# EAGLE design RallyESP_Shield_V1 (EAGLE 9.6.2)
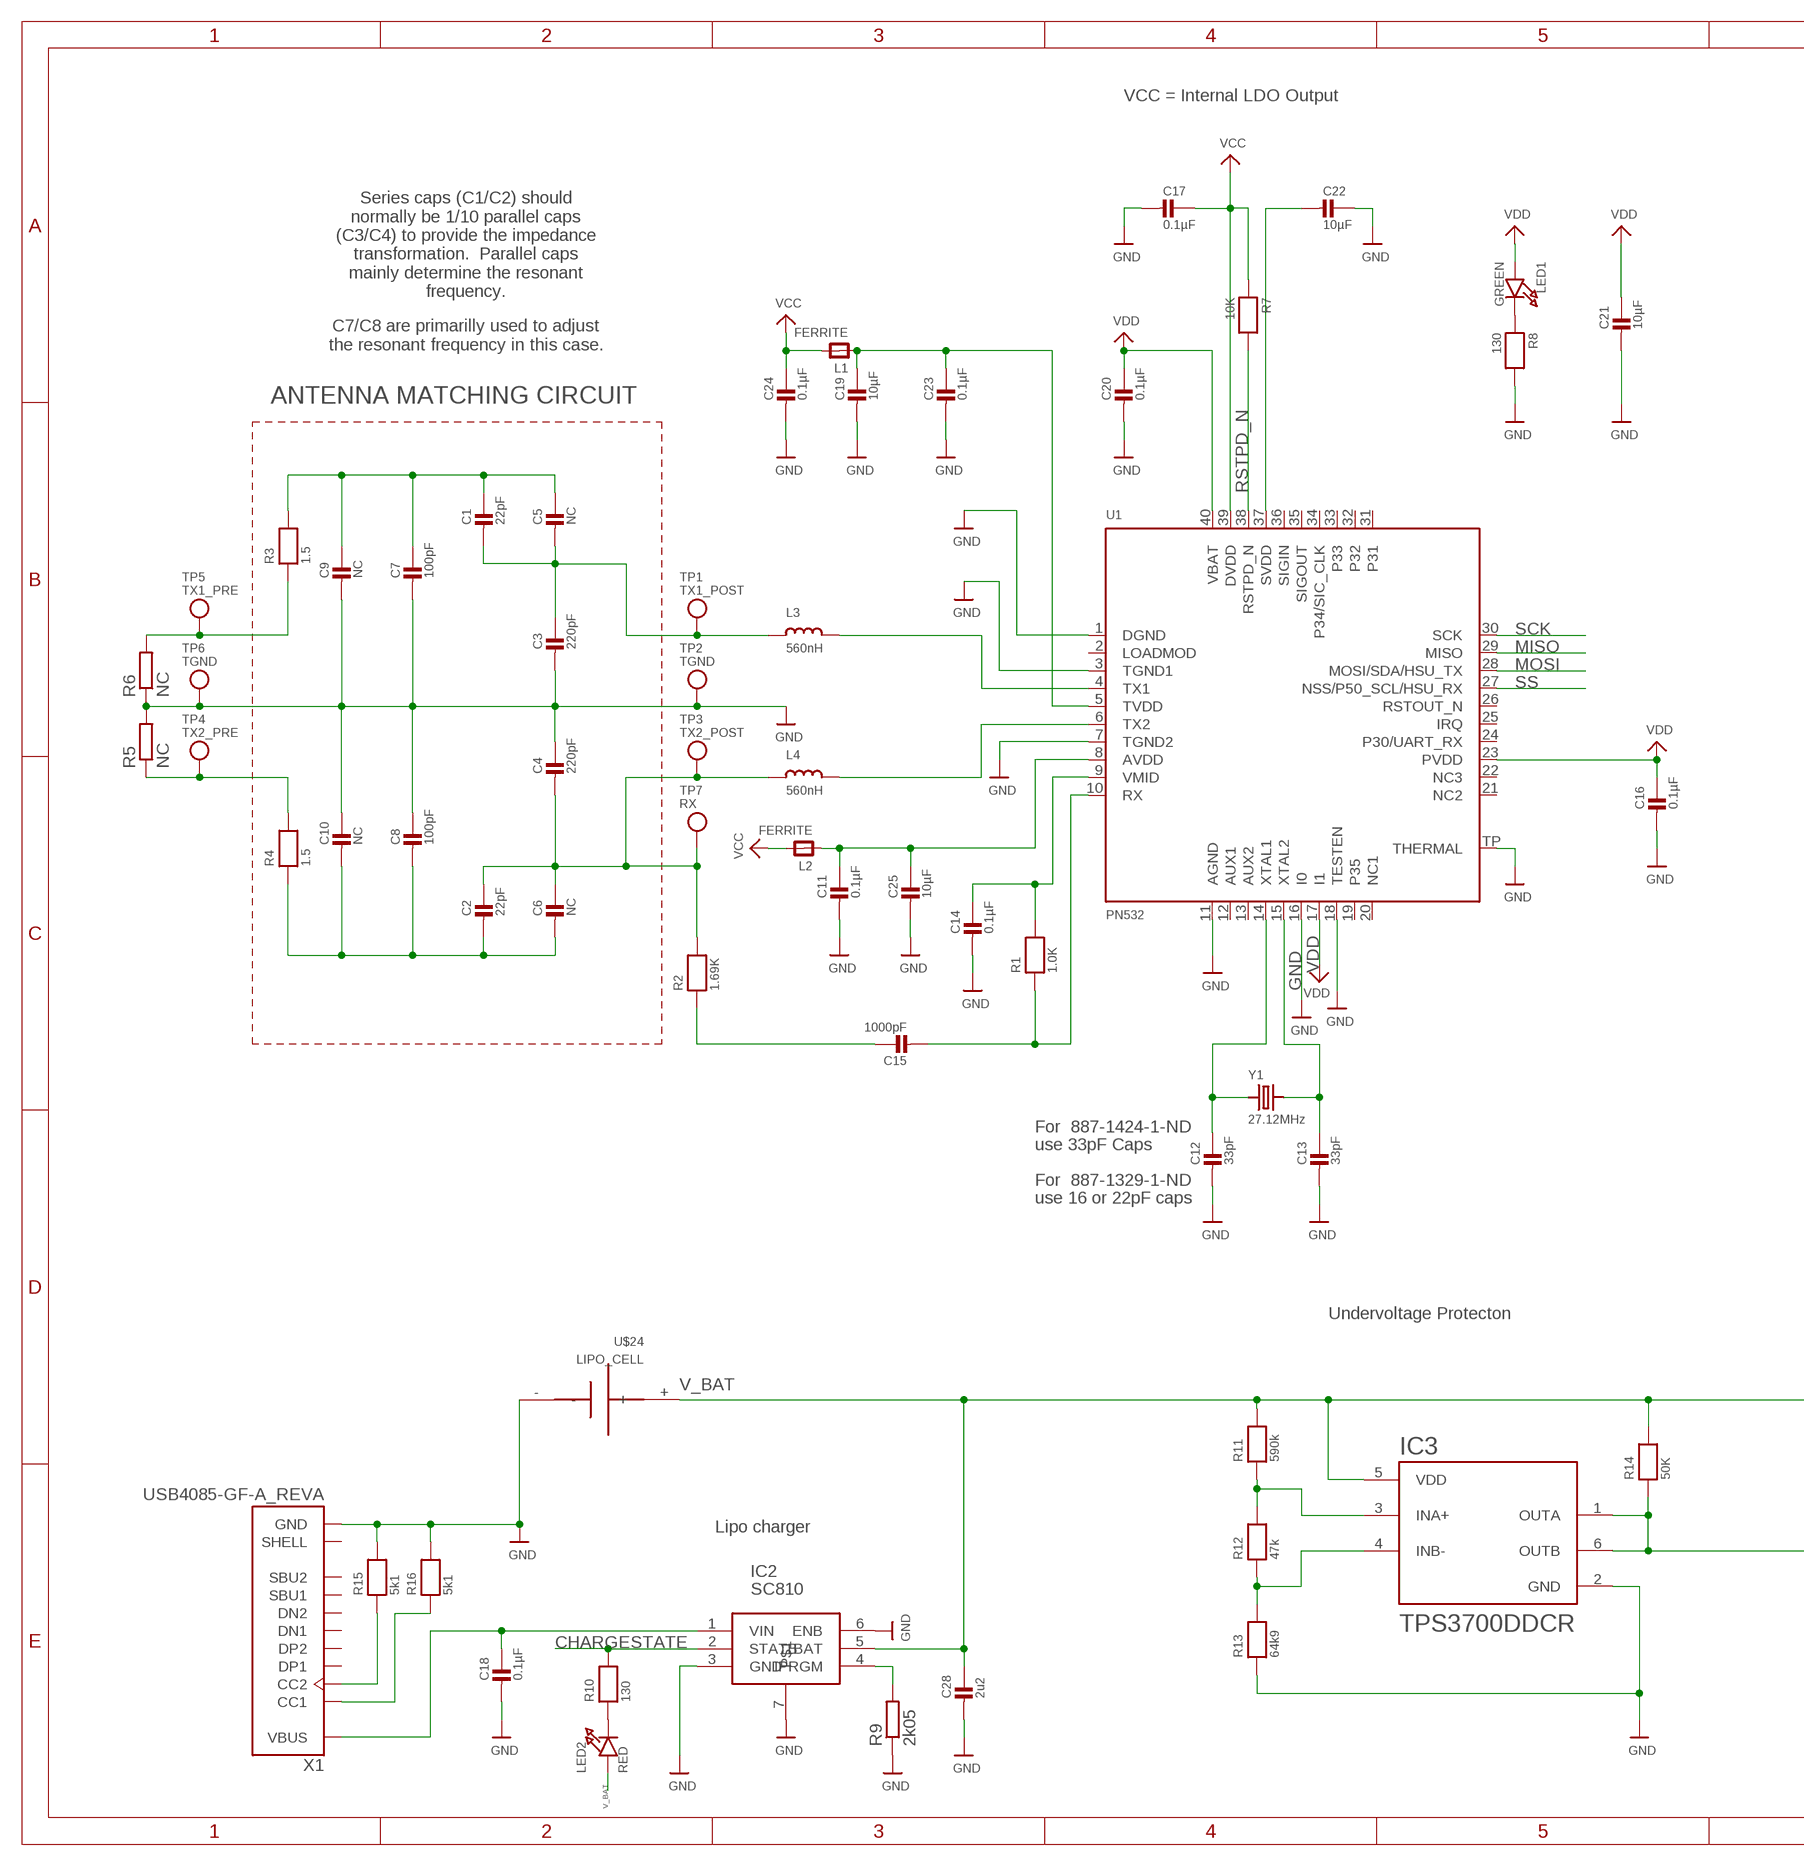
[diagram p0: schematic, sheet 1, part 1 of 2]
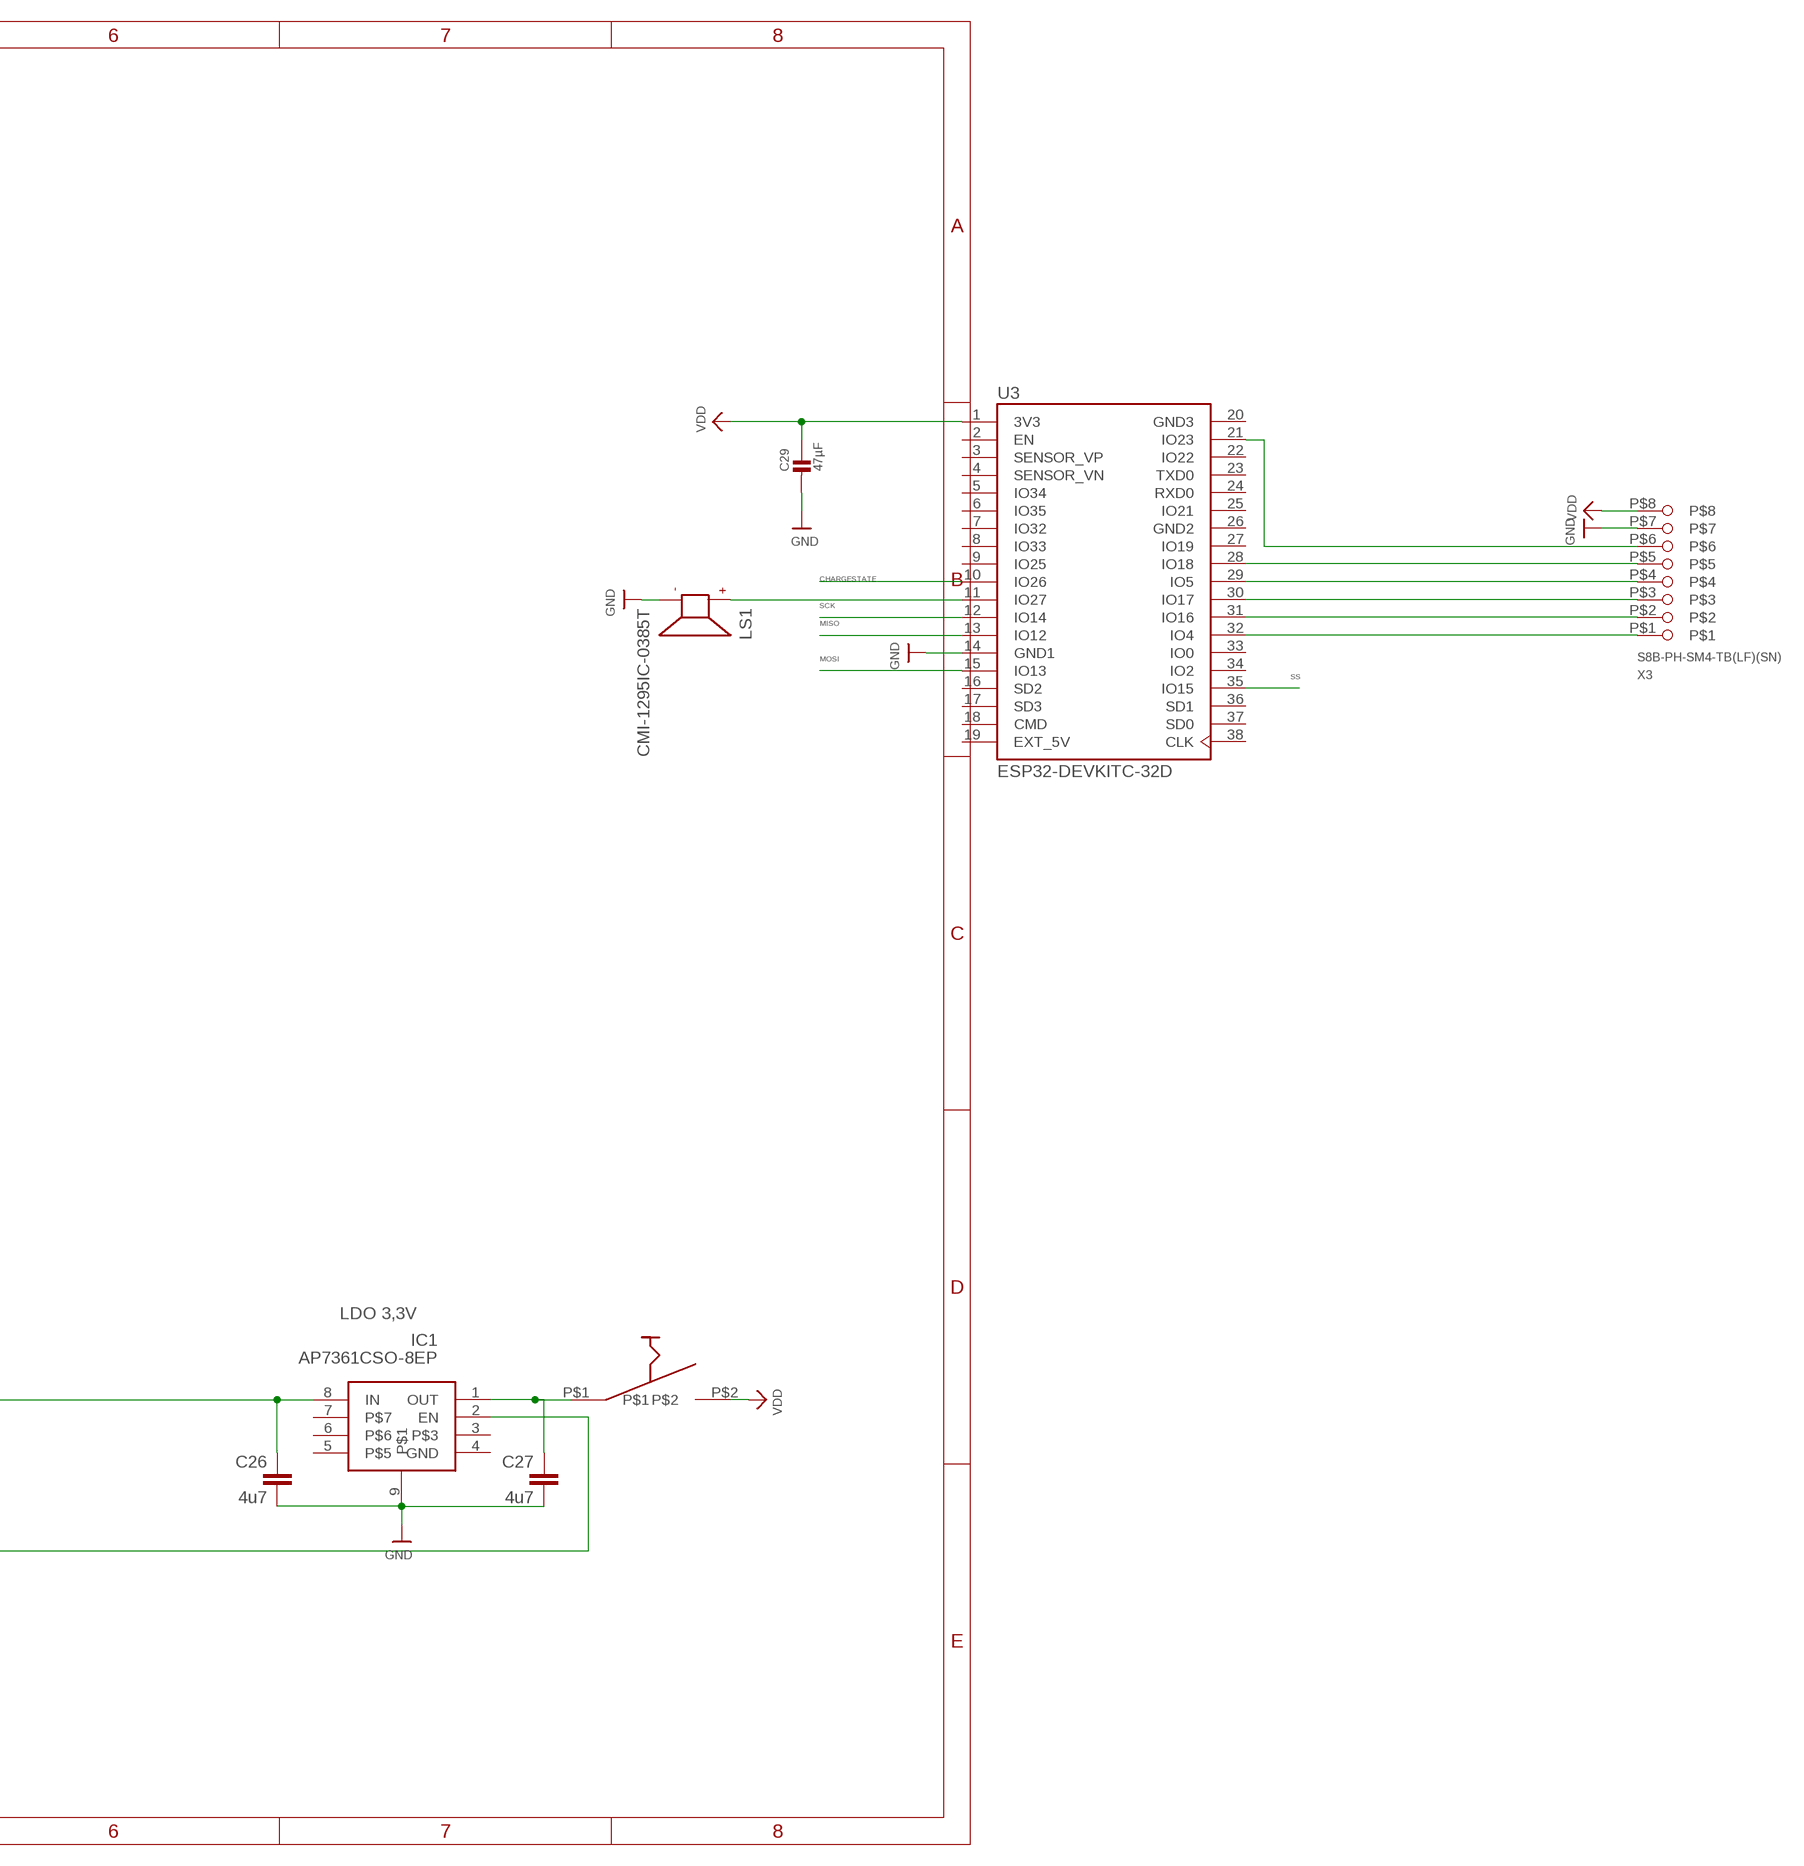
[diagram p1: schematic, sheet 1, part 2 of 2]

## Parts
C1  22pF  CAP_CERAMIC0805-NOOUTLINE  [0805-NO]
C2  22pF  CAP_CERAMIC0805-NOOUTLINE  [0805-NO]
C3  220pF  CAP_CERAMIC0805-NOOUTLINE  [0805-NO]
C4  220pF  CAP_CERAMIC0805-NOOUTLINE  [0805-NO]
C5  NC  CAP_CERAMIC0805-NOOUTLINE  [0805-NO]
C6  NC  CAP_CERAMIC0805-NOOUTLINE  [0805-NO]
C7  100pF  CAP_CERAMIC0805-NOOUTLINE  [0805-NO]
C8  100pF  CAP_CERAMIC0805-NOOUTLINE  [0805-NO]
C9  NC  CAP_CERAMIC0805-NOOUTLINE  [0805-NO]
C10  NC  CAP_CERAMIC0805-NOOUTLINE  [0805-NO]
C11  0.1µF  CAP_CERAMIC0805-NOOUTLINE  [0805-NO]
C12  33pF  CAP_CERAMIC0805-NOOUTLINE  [0805-NO]
C13  33pF  CAP_CERAMIC0805-NOOUTLINE  [0805-NO]
C14  0.1µF  CAP_CERAMIC0805-NOOUTLINE  [0805-NO]
C15  1000pF  CAP_CERAMIC0805-NOOUTLINE  [0805-NO]
C16  0.1µF  CAP_CERAMIC0805-NOOUTLINE  [0805-NO]
C17  0.1µF  CAP_CERAMIC0805-NOOUTLINE  [0805-NO]
C18  0.1µF  CAP_CERAMIC0805-NOOUTLINE  [0805-NO]
C19  10µF  CAP_CERAMIC0805-NOOUTLINE  [0805-NO]
C20  0.1µF  CAP_CERAMIC0805-NOOUTLINE  [0805-NO]
C21  10µF  CAP_CERAMIC0805-NOOUTLINE  [0805-NO]
C22  10µF  CAP_CERAMIC0805-NOOUTLINE  [0805-NO]
C23  0.1µF  CAP_CERAMIC0805-NOOUTLINE  [0805-NO]
C24  0.1µF  CAP_CERAMIC0805-NOOUTLINE  [0805-NO]
C25  10µF  CAP_CERAMIC0805-NOOUTLINE  [0805-NO]
C26  4u7  C-EUC0805  [C0805]
C27  4u7  C-EUC0805  [C0805]
C28  2u2  CAP_CERAMIC0805-NOOUTLINE  [0805-NO]
C29  47µF  CAP_CERAMIC0805-NOOUTLINE  [0805-NO]
IC1  AP7361CSO-8EP  [SOIC127P595X150-9T240X300N]
IC2  SC810  [MLPD-UT6]
IC3  TPS3700DDCR  [SOT95P280X110-6N]
L1  FERRITE  FERRITE0805  [0805]
L2  FERRITE  FERRITE0805  [0805]
L3  560nH  INDUCTOR0805  [0805]
L4  560nH  INDUCTOR0805  [0805]
LED1  GREEN  LED0805_NOOUTLINE  [CHIPLED_0805_NOOUTLINE]
LED2  RED  LED0805_NOOUTLINE  [CHIPLED_0805_NOOUTLINE]
LS1  CMI-1295IC-0385T  [CUI_CMI-1295IC-0385T]
R1  1.0K  RESISTOR0805_NOOUTLINE  [0805-NO]
R2  1.69K  RESISTOR0805_NOOUTLINE  [0805-NO]
R3  1.5  RESISTOR0805_NOOUTLINE  [0805-NO]
R4  1.5  RESISTOR0805_NOOUTLINE  [0805-NO]
R5  NC  R-EU_R0201  [R0201]
R6  NC  R-EU_R0201  [R0201]
R7  10K  RESISTOR0805_NOOUTLINE  [0805-NO]
R8  130  RESISTOR0805_NOOUTLINE  [0805-NO]
R9  2k05  R-EU_R0805  [R0805]
R10  130  RESISTOR0805_NOOUTLINE  [0805-NO]
R11  590k  RESISTOR0805_NOOUTLINE  [0805-NO]
R12  47k  RESISTOR0805_NOOUTLINE  [0805-NO]
R13  64k9  RESISTOR0805_NOOUTLINE  [0805-NO]
R14  50K  RESISTOR0805_NOOUTLINE  [0805-NO]
R15  5k1  RESISTOR0805_NOOUTLINE  [0805-NO]
R16  5k1  RESISTOR0805_NOOUTLINE  [0805-NO]
TP1  TX1_POST  TESTPOINTROUND1MM  [TESTPOINT_ROUND_1MM]
TP2  TGND  TESTPOINTROUND1MM  [TESTPOINT_ROUND_1MM]
TP3  TX2_POST  TESTPOINTROUND1MM  [TESTPOINT_ROUND_1MM]
TP4  TX2_PRE  TESTPOINTROUND1MM  [TESTPOINT_ROUND_1MM]
TP5  TX1_PRE  TESTPOINTROUND1MM  [TESTPOINT_ROUND_1MM]
TP6  TGND  TESTPOINTROUND1MM  [TESTPOINT_ROUND_1MM]
TP7  RX  TESTPOINTROUND1MM  [TESTPOINT_ROUND_1MM]
U1  PN532  [HVQFN40-6X6]
U3  ESP32-DEVKITC-32D  [MODULE_ESP32-DEVKITC-32D]
U$24  LIPO_CELL  [LIPO_18X65]
U$46  GPTS203211B  [GPTS203211B]
X1  USB4085-GF-A_REVA  [GCT_USB4085-GF-A_REVA]
X3  S8B-PH-SM4-TB(LF)(SN)  [8_PIN_SMD_2MM]
Y1  27.12MHz  CRYSTAL3.2X2.5  [CRYSTAL_3.2X2.5]

## Nets
CHARGESTATE: IC2.2(STATB) R10.2 U3.10(IO26)
GND: C3.2 C4.1 C7.2 C8.1 C9.2 C10.1 C11.2 C12.2 C13.2 C14.2 C16.2 C17.2 C18.2 C19.2 C20.2 C21.2 C22.1 C23.2 C24.2 C25.2 C26.2 C27.2 C28.2 C29.2 IC1.9 IC2.3(GND) IC2.6(ENB) IC2.7 IC3.2(GND) LS1.N R5.2 R6.1 R8.2 R9.1 R13.1 R15.2 R16.2 TP2.P$1 TP6.P$1 U1.1(DGND) U1.3(TGND1) U1.7(TGND2) U1.11(AGND) U1.16(I0) U1.18(TESTEN) U1.TP(THERMAL) U3.14(GND1) U$24.- X1.A1(GND) X1.A12(GND) X1.B1(GND) X1.B12(GND) X3.P$7
MISO: U1.29(MISO) U3.13(IO12)
MOSI: U1.28(MOSI/SDA/HSU_TX) U3.15(IO13)
N$1: L3.2 U1.4(TX1)
N$2: L4.2 U1.6(TX2)
N$3: C1.2 C3.1 C5.2 L3.1 TP1.P$1
N$4: R3.1 R6.2 TP5.P$1
N$5: R4.2 R5.1 TP4.P$1
N$6: LED1.C R8.1
N$7: C12.1 U1.14(XTAL1) Y1.1
N$8: C13.1 U1.15(XTAL2) Y1.2
N$9: C15.1 R2.1
N$10: C14.1 R1.2 U1.9(VMID)
N$11: C15.2 R1.1 U1.10(RX)
N$12: C2.1 C4.2 C6.1 L4.1 R2.2 TP3.P$1 TP7.P$1
N$13: C11.1 C25.1 L2.1 U1.8(AVDD)
N$14: C19.1 C23.1 L1.1 U1.5(TVDD)
N$15: C22.2 U1.37(SVDD)
N$16: LS1.P U3.11(IO27)
N$17: IC3.3(INA+) R11.1 R12.2
N$18: IC3.4(INB-) R12.1 R13.2
N$19: IC1.2(EN) IC3.1(OUTA) IC3.6(OUTB) R14.1
N$20: C27.1 IC1.1(OUT) U$46.P$1
N$21: R15.1 X1.B5(CC2)
N$22: R16.1 X1.A5(CC1)
N$23: U3.32(IO4) X3.P$1
N$25: U3.31(IO16) X3.P$2
N$26: U3.30(IO17) X3.P$3
N$27: U3.29(IO5) X3.P$4
N$28: U3.28(IO18) X3.P$5
N$29: U3.21(IO23) X3.P$6
N$30: IC2.4(IPRGM) R9.2
N$32: LED2.C R10.1
N$34: C18.1 IC2.1(VIN) X1.A4(VBUS) X1.A9(VBUS) X1.B4(VBUS) X1.B9(VBUS)
RSTPD_N: R7.2 U1.38(RSTPD_N)
SCK: U1.30(SCK) U3.12(IO14)
SS: U1.27(NSS/P50_SCL/HSU_RX) U3.35(IO15)
TX1_ANTENNA: C1.1 C5.1 C7.1 C9.1 R3.2
TX2_ANTENNA: C2.2 C6.2 C8.2 C10.2 R4.1
V_BAT: C26.1 C28.1 IC1.8(IN) IC2.5(BAT) IC3.5(VDD) LED2.A R11.2 R14.2 U$24.+
VCC: C17.1 C24.1 L1.2 L2.2 R7.1 U1.39(DVDD)
VDD: C16.1 C20.1 C21.1 C29.1 LED1.A U1.17(I1) U1.23(PVDD) U1.40(VBAT) U3.1(3V3) U$46.P$2 X3.P$8
Unconnected: IC1.3 IC1.4(GND) IC1.5 IC1.6 IC1.7 U1.2(LOADMOD) U1.12(AUX1) U1.13(AUX2) U1.19(P35) U1.20(NC1) U1.21(NC2) U1.22(NC3) U1.24(P30/UART_RX) U1.25(IRQ) U1.26(RSTOUT_N) U1.31 U1.32 U1.33 U1.34(P34/SIC_CLK) U1.35(SIGOUT) U1.36(SIGIN) U3.2(EN) U3.3(SENSOR_VP) U3.4(SENSOR_VN) U3.5(IO34) U3.6(IO35) U3.7(IO32) U3.8(IO33) U3.9(IO25) U3.16(SD2) U3.17(SD3) U3.18(CMD) U3.22(IO22) U3.23(TXD0) U3.24(RXD0) U3.25(IO21) U3.27(IO19) U3.33(IO0) U3.34(IO2) U3.36(SD1) U3.37(SD0) U3.38(CLK) X1.A6(DP1) X1.A7(DN1) X1.A8(SBU1) X1.B6(DP2) X1.B7(DN2) X1.B8(SBU2) X1.P1(SHELL) X1.P2(SHELL) X1.P3(SHELL) X1.P4(SHELL)

## Notes on the sheet
- VCC = Internal LDO Output
- Series caps (C1/C2) should
  normally be 1/10 parallel caps
  (C3/C4) to provide the impedance
  transformation.  Parallel caps
  mainly determine the resonant
  frequency.
- C7/C8 are primarilly used to adjust
  the resonant frequency in this case.
- ANTENNA MATCHING CIRCUIT
- For  887-1424-1-ND
- use 33pF Caps
- For  887-1329-1-ND
- use 16 or 22pF caps
- Undervoltage Protecton | LDO 3,3V
- Lipo charger

## Power pins joined to a net without a drawn wire
EXT_5V: U3.19(EXT_5V)
GND2: U3.26(GND2)
GND3: U3.20(GND3)

## Library data of the parts
C1-C25 C28 C29 = microbuilder:CAP_CERAMIC: Ceramic Capacitors For new designs, use the packages preceded by an '_' character since they are more reliable: The following footprints should be used on most boards: _0402 - Standard footprint for regular board layouts _0603 - Standard footprint for regular board layouts _0805 - Standard footprint for regular board layouts For extremely tight-pitch boards where space is at a premium, the following 'micro-pitch' footprints can be used (smaller pads, no silkscreen outline, etc.): _0402MP - Micro-pitch footprint for very dense/compact boards _0603MP - Micro-pitch footprint for very dense/compact boards _0805MP - Micro-pitch footprint for very dense/compact boards Commonly Stocked Parts 0402 - 0402 Surface Mount Capacitors 16pF 50V 5% [Digikey: 445-4899-2-ND] 18pF 50V 5% [Digikey: 490-1281-2-ND] 22pF 50V 5% [Digikey: 490-1283-2-ND] 68pF 50V 5% [Digikey: 490-1289-2-ND] 0.1uF 10V 10% [Digikey: 490-1318-2-ND] 1.0uF 6.3V 10% [Digikey: 490-1320-2-ND] 0603 - 0603 Surface Mount Capacitors 16 pF 50V 5% [Digikey: 445-5051-2-ND] 22 pF 50V [Digikey: PCC220ACVTR-ND] 33 pF 50V 5% [Digikey: 490-1415-1-ND] 56pF 50V 5% [Digikey: 490-1421-1-ND] 220pF 50V 5% [Digikey: 445-1285-1-ND] 680 pF 50V 2200 pF 50V 5% C0G [Digikey: 445-1297-1-ND] 5600 pF 100V 5% X7R [Digikey: 478-3711-1-ND] 0.1 µF 25V 10% [Digikey: PCC2277TR-ND] 0.22 µF 16V 10% X7R [Digikey: 445-1318-1-ND] 1.0 µF 25V 10% [Digikey: 445-5146-2-ND] 0603 - RF Specific 3pF 250V +/-0.1pF RF [Digikey: 712-1347-1-ND] 18 pF 250V 5% [Digikey: 478-3505-1-ND or 712-1322-1-ND] 56 pF 250V 5% C0G RF [Digikey: 490-4867-1-ND] 68 pF 250V RF [Digikey: 490-4868-1-ND] 0805 - 0805 Surface Mount Capacitors 220 pF 250V 2% RF Ceramic Capacitor [Digikey: 712-1398-1-ND] 1000 pF 50V 2% NP0 Ceramic Capacitor [Digikey: 478-3760-1-ND] 0.1 µF 25V 10% Ceramic Capacitor [Digikey: PCC1828TR-ND] 1.0 µF 16V 10% Ceramic Capacitor[Digikey: 490-1691-2-ND] 10.0 µF 10V 10% Ceramic Capacitor[Digikey: 709-1228-1-ND] 10.0 uF 16V 10% Ceramic Capacitor [Digikey: 478-5165-2-ND] 47 uF 6.3V 20% Ceramic Capacitor [Digikey: 587-1779-1-ND or 399-5506-1-ND] 1206 - 1206 Surface Mount Capacitors 47uF 10V 20% Ceramic Capacitor [Digikey: 490-5528-1-ND or 399-5508-1-ND or 445-6010-1-ND] 100uF 6.3V -20%, +80% Y5V Ceramic Capacitor (Digikey: 490-4512-1-ND, Mouser: 81-GRM31CF50J107ZE1L)
C26 C27 = rcl:C-EU: CAPACITOR, European symbol; SPICEPREFIX: C
IC1 = rallyESP_lib:AP7361C
IC2 = rallyESP_lib:SC810
IC3 = TPS3700DDCR:TPS3700DDCR: High-voltage (18-V) window voltage detector for overvoltage and undervoltage monitoring 6-SOT-23-THIN -40 to 125 Check prices <https://pricing.snapeda.com/parts/TPS3700DDCR/Texas%20Instruments/view-part?ref=eda>; AVAILABILITY: Warning; DESCRIPTION: High-voltage (18-V) window voltage detector for overvoltage and undervoltage monitoring 6-SOT-23-THIN -40 to 125; MF: Texas Instruments; MP: TPS3700DDCR; PACKAGE: SOT-23-THN-6 Texas Instruments; PRICE: None; PURCHASE-URL: https://pricing.snapeda.com/search/part/TPS3700DDCR/?ref=eda
L1 L2 = microbuilder:FERRITE: Ferrite Bead 0603 MMZ1608B121C - 120 Ohm @ 100MHz, 600mA, 0.15 Ohm DC Resistance - Digikey: 445-2164-1-ND BK1608HW121-T - 120 Ohm, 600mA Ferrite Chip - Digikey: 587-1876-2-ND 0805 HZ0805B272R-10 - 2.7K Ohm @ 100MHz, 200mA, 0.8 Ohm DC Resistance - Digikey: 240-2504-1-ND (see also Murata BLM21BD272SN1L) MMZ2012Y152B - 1.5K Ohm @ 100MHz, 500mA, 0.4 Ohm DC Resistance - Digikey: 445-1560-1-ND - Mainly for high frequency (80-400MHz) MMZ2012R102A - 1K Ohm @ 100MHz, 500mA, 0.3 Ohm DC Resistance - Digikey: 445-1555-2-ND - More general purpose (10-200MHz)
L3 L4 = microbuilder:INDUCTOR: Inductors 0603: 10nH Ceramic Inductor - microwire antenna/RF (Digikey: 712-1434-2-ND) 0805: 560nH Ceramic Inductor - RF (Digikey: 553-1047-1-ND) 270nH Ceramic Inductor - Q = 40@250MHz, +-5%, 1 Ohm DC Resistance (Digikey: 535-10506-2-ND) 1007 (2518 Metric) SMT: 10µH 10% 250mOhm 820mA 1007 Inductor (Digikey: 587-2189-1-ND) 22µH 10% 500mOhm 580mA 1007 Inductor (Digikey: 587-2190-1-ND) 47µH 10% 950mOhm 420mA 1007 Inductor (Digikey: 587-2191-1-ND) 47µH 5% 100mOhm 1A 1008 Inductor (Digikey: 732-1816-1-ND) 5.0x5.0mm (Taiyo Yuden NR5040 Series) 6.8µH 20% 2.3A 64mOhm Inductor (Digikey: 587-2374-2-ND) 5.0x5.0mm (TDK VLC5045 Series) 4.7µH 20% 3.3A 34mOhm Inductor (Digikey: 445-6526-1-ND) 6.8µH 20% 2.7A 46mOhm Inductor (Digikey: 445-6527-1-ND) 6.0x6.0mm (TDK VLC6045 Series) 4.7µH 20% 3.8A 27mOhm Inductor (Digikey: 445-6538-2-ND) 6.8µH 20% 3A 41mOhm Inductor (Digikey: 445-6540-1-ND) 6.2µH 30% 2.2A 45mOhm Inductor (Digikey: SRR5028-6R2YCT-ND) - Not TDK VLC6045 but footprint should match 6.0x6.0mm (TDK SLF6045 Series) 6.8uH 30% 2A 33mOhm Inductor (Digikey: 445-4572-1-ND, Mouser: 810-SLF645T6R8N2R0PF) 6.0x6.0mm (Sumida CDRH5D28 Series) 6.2uH 30% 1.8A 45mOhm Inductor (Digikey: 308-1542-1-ND) Taiyo Yuden NR3015T2R2M - 2.2uH 20% 1.5A (Digikey: 587-1648-2-ND, Mouser: 963-NR3015T2R2M) - Used with TI TPS62172 CoilCraft RFID Transponder Coil - MA5532-AE (For use with AS3935 Lightning Sensor)
LED1 LED2 = microbuilder:LED: LED 0603 - 0603 Surface Mount Package 2mA: Green LED - Low Power (3.9mcd, 2ma, 1.7Vf) - Digikey: 475-2709-2-ND Orange LED - Low Power (9.8mcd, 2ma, 1.8Vf) - Digikey: 475-1194-2-ND Red LED - Low Power (5mcd, 2ma, 1.8Vf) - Digikey: 475-1195-2-ND Yellow LED - Low Power (7mcd, 2ma, 1.8Vf) - Digikey: 475-1196-2-ND 5mA: Blue LED - Low Power (17mcd, 5ma, 2.9Vf) - Digikey: LNJ937W8CRACT-ND 0805 - 0805 Surface Mount Package 2mA: Red LED (8.8mcd, 2mA, 1.8Vf, Clear) - Low Power [Digikey: 475-2510-1-ND] Green LED (5mcd, 2mA, 1.8Vf, Clear) - Low Power [Digikey: 475-2730-1-ND] Yellow LED (11.3mcd, 2mA, 1.8Vf, Clear) - Low Power [Digikey: 475-2555-1-ND] 20mA: Red LED (104mcd, 20mA, Diffused) - LS R976 [Digikey: 475-1278-6-ND] Red LED (12mcd, 20mA, 2.0Vf, Clear) - APT2012EC [Digikey: 754-1128-1-ND] Green LED (15mcd, 20mA, 2.2Vf, Clear) - APT2012GC [Digikey: 754-1131-1-ND] Orange LED (160mcd, 20mA, 2.1Vf, Clear) - APT2012SECK [Digikey: 754-1130-1-ND] 1206 - 1206 Surface Mount Package Green LED (26mcd, 20mA, Diffused) - LG N971 [Digikey: 475-1407-6-ND] Red LED (15mcd, 20mA, Diffused) - LH N974 [Digikey: 475-1416-6-ND] Cree - Cree High-Power Surface Mount LEDs XPEBWT-L1-0000-00D50 - White 111lm 350mA 2.9Vf 6200K 110° XTEAWT-00-0000-00000LEE3 - White 114lm 350mA 2.85Vf 5000K 115° Everlight - Everlight 45-21 Series Surface Mount LEDs 45-21/QK2C-B2832AC2CB2/2T - Warm White 2000mcd 20mA 3.25Vf 3050K 120° 45-21/LK2C-B38452C4CB2/2T - Nuetral White 2000mcd 20mA 3.25Vf 4150K 120° 45-21/LK2C-B50634C6CB2/2T - Cold White 2200mcd 20mA 3.25Vf 5650K 120° PLCC2 Reverse Mount LS T77K-J1L2-1-0-2-R18-Z - Red 11.25mcd 2mA 1.8Vf 630nm 120° LO T77K-L1M2-24-Z - Orange 19.6mcd 2mA 1.8Vf 606nm 120° LY T77K-K2M1-26-Z - Yellow 15.7mcd 2mA 1.8Vf 587nm 120°
LS1 = CMI-1295IC-0385T:CMI-1295IC-0385T: MAGNETIC BUZZER INDICATOR; MANUFACTURER: CUI Inc.; MAXIMUM_PACKAGE_HEIGHT: 9.7mm; PARTREV: 1.0; STANDARD: Manufacturer Recommendations
R1-R4 R7 R8 R10-R16 = microbuilder:RESISTOR: Resistors For new designs, use the packages preceded by an '_' character since they are more reliable: The following footprints should be used on most boards: _0402 - Standard footprint for regular board layouts _0603 - Standard footprint for regular board layouts _0805 - Standard footprint for regular board layouts For extremely tight-pitch boards where space is at a premium, the following 'micro-pitch' footprints can be used (smaller pads, no silkscreen outline, etc.): _0402MP - Micro-pitch footprint for very dense/compact boards _0603MP - Micro-pitch footprint for very dense/compact boards _0805MP - Micro-pitch footprint for very dense/compact boards
R5 R6 R9 = rcl:R-EU_: RESISTOR, European symbol; SPICEPREFIX: R
TP1-TP7 = microbuilder:TESTPOINT: Test Point Various test points for characterisation and PCB testing TESTPOINT_SMT - Compact Surface Mount Test Point [Digikey: 5016KTR-ND]
U1 = microbuilder:PN532: PN532 - Near Field Communication (NFC) controller Highly integrated transceiver module for contactless communication at 13.56 MHz (14443A/MIFARE, FeliCa, I4443B)
U3 = ESP32-DEVKITC-32D:ESP32-DEVKITC-32D: Eval Board For Esp-Wroom-32 Check prices <https://pricing.snapeda.com/parts/ESP32-DEVKITC-32D/Espressif%20Systems/view-part?ref=eda>; AVAILABILITY: Warning; DESCRIPTION: EVAL BOARD FOR ESP-WROOM-32; MF: Espressif Systems; MP: ESP32-DEVKITC-32D; PACKAGE: None; PRICE: None; PURCHASE-URL: https://pricing.snapeda.com/search/part/ESP32-DEVKITC-32D/?ref=eda
U$24 = rallyESP_lib:LIPO_CELL
U$46 = rallyESP_lib:GPTS203211B
X1 = USB4085-GF-A_REVA:USB4085-GF-A_REVA: USB 2.0 Type C Receptacle Dip Type, PCB Top Mount Check prices <https://pricing.snapeda.com/parts/USB4085-GF-A/Global%20Connector%20Technology/view-part?ref=eda>; AVAILABILITY: Warning; DESCRIPTION: USB-C (USB TYPE-C) USB 2.0 Receptacle Connector 24 (16+8 Dummy) Position Through Hole, Right Angle, low cost, 3.46mm profile, 16 pin, horizontal, Top mount; MF: Global Connector Technology; MP: USB4085-GF-A; PACKAGE: Package; PRICE: None; PURCHASE-URL: https://pricing.snapeda.com/search/part/USB4085-GF-A/?ref=eda
X3 = rallyESP_lib:S8B-PH-SM4-TB(LF)(SN)
Y1 = microbuilder:CRYSTAL: Crystals HC49UP - Surface Mount Crystal 4.0MHz 18pF +/-30ppm Surface Mount Crystal [Digikey: 535-9857-1-ND] 12.0 MHz Surface Mount Crystal [Digikey: 535-9869-6-ND] 25.0 MHz Surface Mount Crystal [Digikey: 535-9078-1-ND] 2.5 x 2.0mm - MEMs SMT Crystal 16.0 MHz 10pF 20ppm 2.5 x 2.0mm Crystal [Digikey -40-85°C: 535-10923-1-ND] 3.2 x 2.5mm - MEMs SMT Crystal 12.0 MHz 8pF 15ppm 3.2 x 2.5mm Crystal [Digikey: -10-70°C: 644-1047-1-ND -40-125°C: 644-1128-1-ND] 40~85°C cheaper: 644-1173-6-ND 16.0 MHz 8pF 15ppm 3.2 x 2.5mm Crystal [Digikey: -10-70°C: 644-1049-1-ND -40-125°C: 644-1129-2-ND]-40~85°C cheaper: 644-1175-6-ND 16.0 MHz 10pF 10ppm 3.2 x 2.5mm Crystal [Digikey: 644-1100-1-ND] 27.12 MHz 18pF 30ppm 3.2 x 2.5mm Crystal [Digikey: 887-1424-1-ND] 27.12MHz 10pF 10ppm 3.2 x 2.5mm Crystal [Digikey: 887-1329-1-ND] 4.9 x 1.8mm - MEMs SMT Crystal 32.768 KHz 12.5pF 20ppm 4.9 x 1.8mm Crystal [Digikey: SE2415CT-ND] 8.0 x 3.8mm - Surface Mount Crystal 32.768kHz 12.5pF 20ppm -40°C-85°C [Digikey: 535-9166-2-ND] Cylinder 32.768KHz Cylinder Crystal (2x6mm body) [Ex. Digikey: 300-8341-2-ND]

## Board
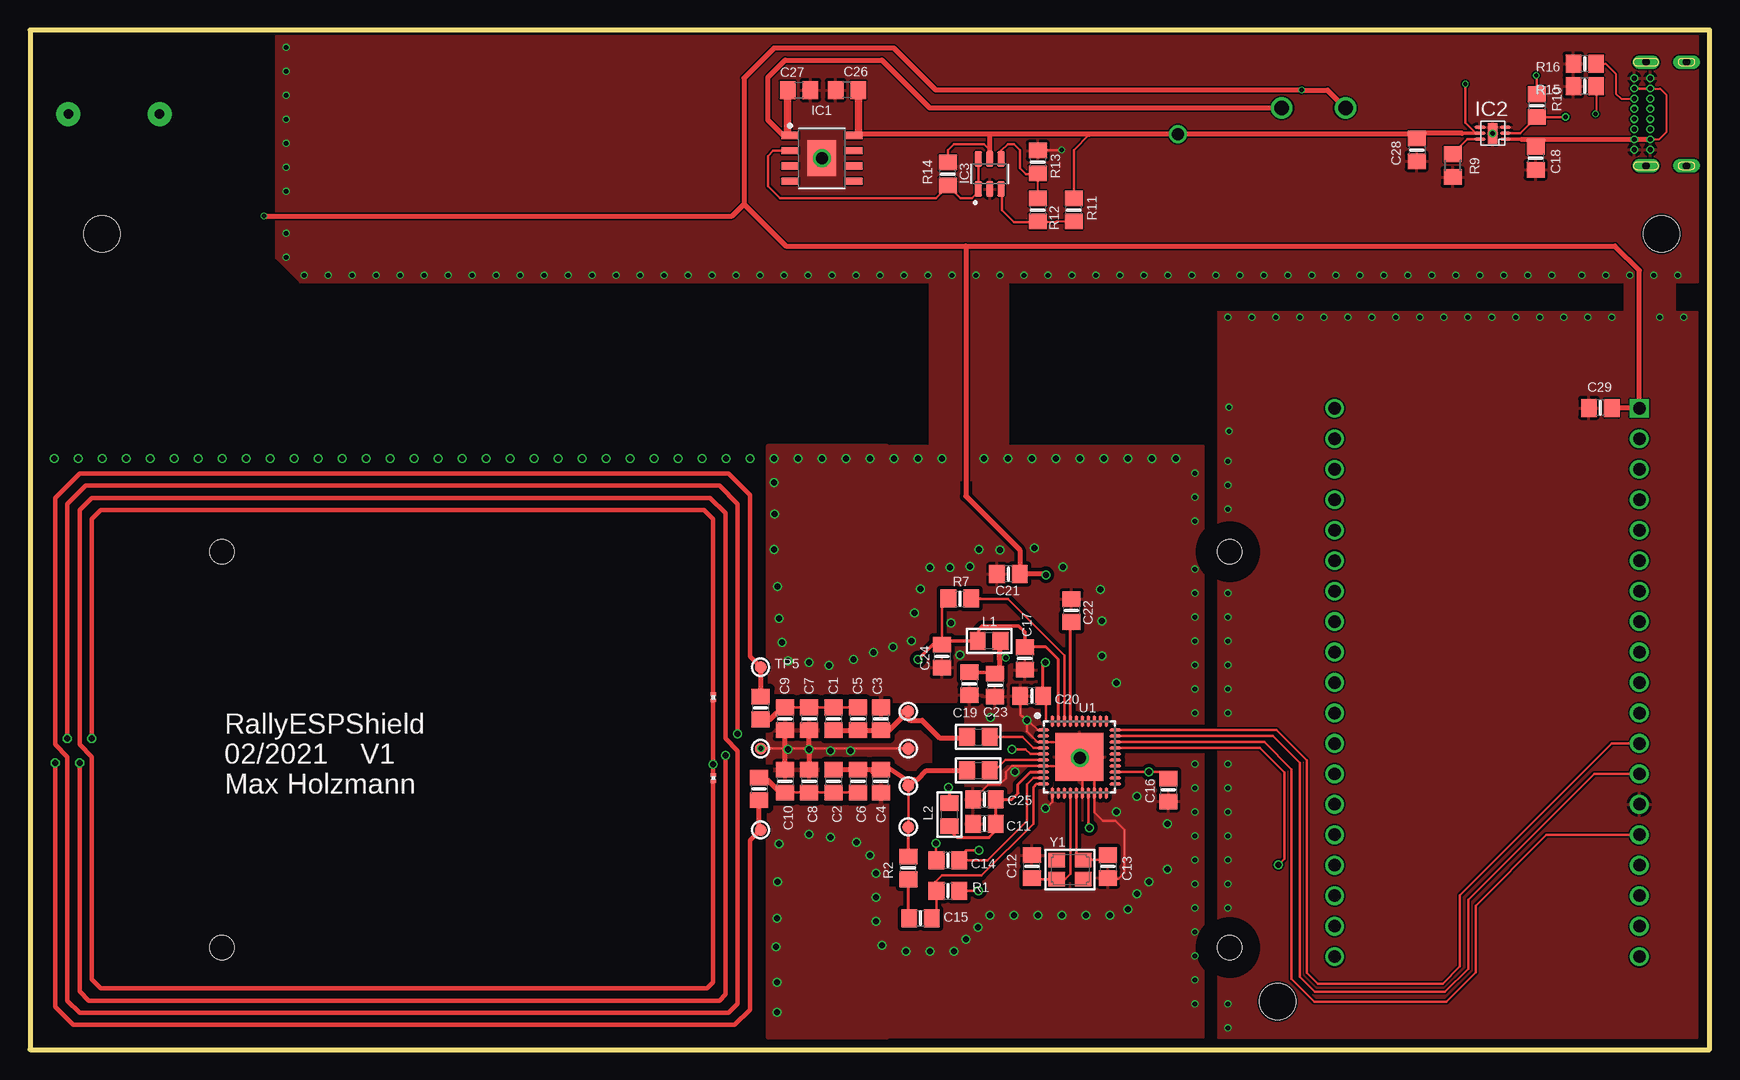
[diagram p2: board, top side]
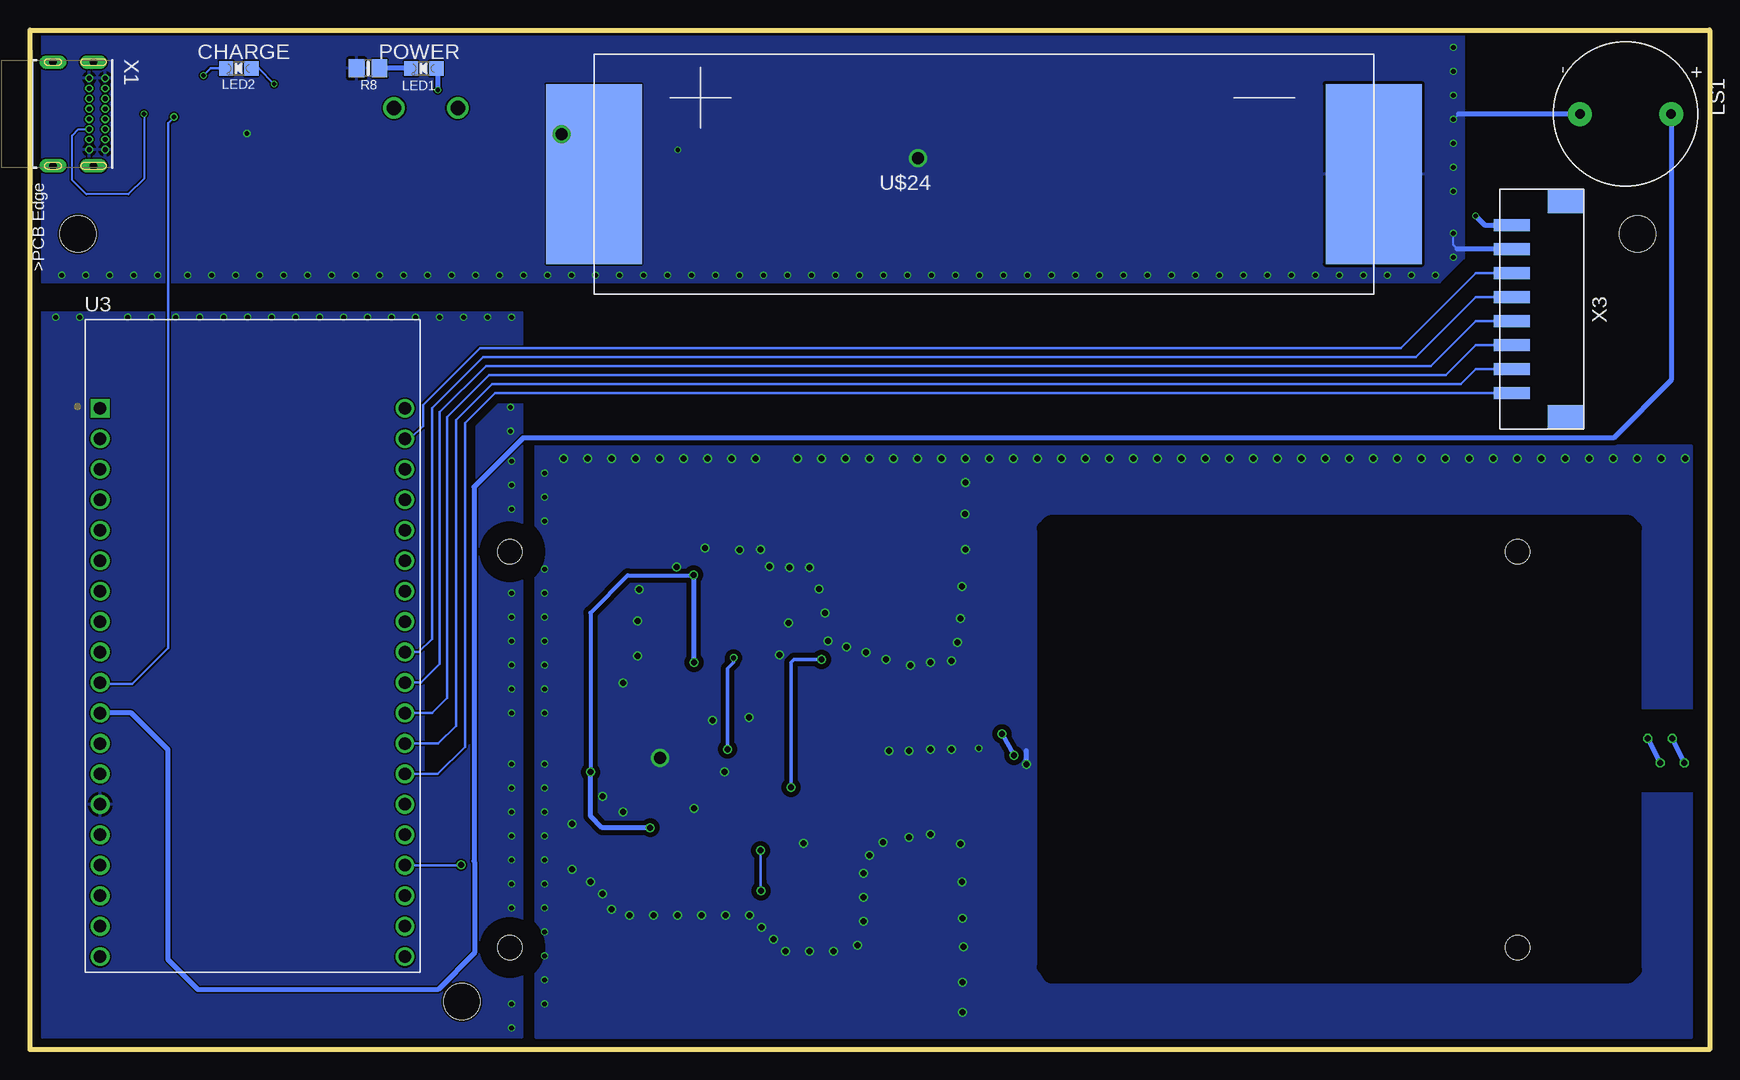
[diagram p3: board, bottom side, seen from below]

Size 140 x 85 mm. Coordinates in mm from the lower left corner, seen from the top.
Outline: 0,0 140,0 140,85 0,85 0,0
Copper layers (1*16): Top 0.035559375mm / dielectric 1.6mm / Bottom 0.035559375mm
Design rules "jlcpcb2layer": minimum track width 5mil, minimum drill 12mil, track to track 5mil, track to pad 5mil, pad to pad 5mil, via to via 5mil, smd to smd 5mil, copper to edge 8mil, drill to drill 6mil, minimum pad ring 5mil, minimum via ring 3mil, stop-mask expansion 2.5mil, vias tented up to drill 0mil, thermal gap 10mil
Holes 2 mm at 16,41.5 16,8.5 100,8.5 100,41.5
Holes 3 mm at 6,68 104,4 136,68
tRestrict: area 98.7,40.2 to 101.3,42.8; area 98.7,7.2 to 101.3,9.8; area 14.7,7.2 to 17.3,9.8; area 14.7,40.2 to 17.3,42.8
bRestrict: area 0.6,26.7 to 5.7,28; area 0.6,21.9 to 5.7,23.1; area 6.2,6.1 to 55.5,44; area 14.7,40.2 to 17.3,42.8; area 98.7,40.2 to 101.3,42.8; area 98.7,7.2 to 101.3,9.8; area 14.7,7.2 to 17.3,9.8; area 98.5,23 to 107,58.5

### Footprints (pad centres in the part's own frame; a part is rotated, then mirrored left to right if it is on the bottom)
0805-NO = smd 1.3 x 1.5: 1 -0.95,0; 2 0.95,0
C0805 = smd 1.3 x 1.5: 1 -0.95,0; 2 0.95,0
SOIC127P595X150-9T240X300N = smd 1.46 x 0.602: 1 -2.645,1.905; 2 -2.645,0.635; 3 -2.645,-0.635; 4 -2.645,-1.905; 5 2.645,-1.905; 6 2.645,-0.635; 7 2.645,0.635; 8 2.645,1.905 | smd 2.4 x 3: 9 0,0
MLPD-UT6 = smd 0.9 x 0.3: 1 -1.05,0.5; 2 -1.05,0; 3 -1.05,-0.5; 4 1.05,0.5; 5 1.05,0; 6 1.05,-0.5 | smd 0.8 x 1.7: 7 0,0
SOT95P280X110-6N = smd 1.25 x 0.59: 1 -1.255,0.95; 2 -1.255,0; 3 -1.255,-0.95; 4 1.255,-0.95; 5 1.255,0; 6 1.255,0.95
0805 = smd 1.3 x 1.5: 1 -0.95,0; 2 0.95,0
CHIPLED_0805_NOOUTLINE = smd 1.2 x 1.2: A 0,-1.05; C 0,1.05
CUI_CMI-1295IC-0385T = drill 0.8 pad 2: N 0,-3.8; P 0,3.8
R0201 = smd 0.28 x 0.43: 1 -0.255,0; 2 0.255,0
R0805 = smd 1.3 x 1.5: 1 -0.95,0; 2 0.95,0
TESTPOINT_ROUND_1MM = smd 1 x 1: P$1 0,0
HVQFN40-6X6 = smd 1 x 0.25: 1 -2.99,2.25; 2 -2.99,1.75; 3 -2.99,1.25; 4 -2.99,0.75; 5 -2.99,0.25; 6 -2.99,-0.25; 7 -2.99,-0.75; 8 -2.99,-1.25; 9 -2.99,-1.75; 10 -2.99,-2.25; 21 2.99,-2.25; 22 2.99,-1.75; 23 2.99,-1.25; 24 2.99,-0.75; 25 2.99,-0.25; 26 2.99,0.25; 27 2.99,0.75; 28 2.99,1.25; 29 2.99,1.75; 30 2.99,2.25 | smd 0.25 x 1: 11 -2.25,-2.99; 12 -1.75,-2.99; 13 -1.25,-2.99; 14 -0.75,-2.99; 15 -0.25,-2.99; 16 0.25,-2.99; 17 0.75,-2.99; 18 1.25,-2.99; 19 1.75,-2.99; 20 2.25,-2.99; 31 2.25,2.99; 32 1.75,2.99; 33 1.25,2.99; 34 0.75,2.99; 35 0.25,2.99; 36 -0.25,2.99; 37 -0.75,2.99; 38 -1.25,2.99; 39 -1.75,2.99; 40 -2.25,2.99 | smd 4 x 4: TP 0,0
MODULE_ESP32-DEVKITC-32D = drill 1.04 square: 1 -12.7,19.76 | drill 1.04: 2 -12.7,17.22; 3 -12.7,14.68; 4 -12.7,12.14; 5 -12.7,9.6; 6 -12.7,7.06; 7 -12.7,4.52; 8 -12.7,1.98; 9 -12.7,-0.56; 10 -12.7,-3.1; 11 -12.7,-5.64; 12 -12.7,-8.18; 13 -12.7,-10.72; 14 -12.7,-13.26; 15 -12.7,-15.8; 16 -12.7,-18.34; 17 -12.7,-20.88; 18 -12.7,-23.42; 19 -12.7,-25.96; 20 12.7,19.76; 21 12.7,17.22; 22 12.7,14.68; 23 12.7,12.14; 24 12.7,9.6; 25 12.7,7.06; 26 12.7,4.52; 27 12.7,1.98; 28 12.7,-0.56; 29 12.7,-3.1; 30 12.7,-5.64; 31 12.7,-8.18; 32 12.7,-10.72; 33 12.7,-13.26; 34 12.7,-15.8; 35 12.7,-18.34; 36 12.7,-20.88; 37 12.7,-23.42; 38 12.7,-25.96
LIPO_18X65 = smd 8 x 15: + 0,0; - 65,0
GPTS203211B = drill 1.2: P$1 0,2.65; P$2 0,-2.65
GCT_USB4085-GF-A_REVA = drill 0.4 pad 0.65: A1 -2.975,4.025; A4 -2.125,4.025; A5 -1.275,4.025; A6 -0.425,4.025; A7 0.425,4.025; A8 1.275,4.025; A9 2.125,4.025; A12 2.975,4.025; B1 2.975,2.675; B4 2.125,2.675; B5 1.275,2.675; B6 0.425,2.675; B7 -0.425,2.675; B8 -1.275,2.675; B9 -2.125,2.675; B12 -2.975,2.675 | drill 0.6 pad 1.108 long: P1 -4.325,3.045; P2 4.325,3.045; P3 4.325,-0.335; P4 -4.325,-0.335
8_PIN_SMD_2MM = smd 3 x 1: P$1 0,8; P$2 0,6; P$3 0,4; P$4 0,2; P$5 0,0; P$6 0,-2; P$7 0,-4; P$8 0,-6 | smd 3 x 2: P$9 -4.5,10; P$10 -4.5,-8
CRYSTAL_3.2X2.5 = smd 1.4 x 1.2: 1 -1.1,-0.8; 2 1.1,0.8; GND1 -1.1,0.8; GND2 1.1,-0.8

### Placement (x,y rotation side)
C1  66.99,27.57 270 top
C2  66.99,22.38 270 top
C3  70.92,27.57 90 top
C4  70.92,22.38 90 top
C5  69.01,27.57 270 top
C6  69.01,22.38 270 top
C7  64.96,27.57 270 top
C8  64.96,22.38 270 top
C9  62.93,27.57 270 top
C10  62.93,22.38 270 top
C11  79.56,18.82 180 top
C12  83.52,15.26 90 top
C13  89.87,15.26 270 top
C14  76.51,15.77 180 top
C15  74.23,10.96 0 top
C16  94.88,21.63 270 top
C17  82.92,32.6 270 top
C18  125.5,74.3 270 top
C19  78.3,30.5 270 top
C20  83.5,29.48 180 top
C21  81.55,39.64 180 top
C22  86.81,36.6 270 top
C23  80.46,30.37 270 top
C24  76.01,32.78 270 top
C25  79.56,20.85 180 top
C26  68.1,80 180 top
C27  64.1,80 0 top
C28  115.6,75 270 top
C29  130.9,53.5 180 top
IC1  66,74.3 0 top
IC2  121.92,76.38 180 top
IC3  80,73 90 top
L1  79.94,34.05 180 top
L2  76.64,19.58 90 top
L3  79.06,26.05 0 top
L4  79.06,23.26 0 top
LED1  107.18,81.8 90 bottom
LED2  122.6,81.8 90 bottom
LS1  7,78 270 bottom
R1  76.51,13.24 0 top
R2  73.21,15.14 90 top
R3  60.9,28.47 270 top
R4  60.77,21.73 270 top
R5  56.96,29.36 90 top
R6  56.96,22.62 270 top
R7  77.51,37.59 0 top
R8  111.82,81.81 180 bottom
R9  118.6,73.7 90 top
R10  125.6,78.7 270 top
R11  87,70 90 top
R12  84,70 270 top
R13  84,74 270 top
R14  76.5,73 90 top
R15  129.6,80.3 180 top
R16  129.6,82.2 180 top
TP1  73.21,28.2 0 top
TP2  73.21,25.09 0 top
TP3  73.21,21.99 0 top
TP4  60.9,18.31 0 top
TP5  60.9,31.88 0 top
TP6  60.91,25.09 0 top
TP7  73.21,18.56 0 top
U1  87.47,24.39 0 top
U3  121.45,33.7 0 bottom
U$24  93,73 0 bottom
U$46  107,78.5 90 top
X1  137.75,78 270 bottom
X3  16.5,62.75 180 bottom
Y1  86.69,15.01 0 top

### Tracks (layer width: path | path; a pad name or v marks a point on that pad's centre or on a via)
CHARGESTATE  (via drill 0.4 pad 0.2)
  Top 0.203: IC2.2 124.1,76.38 124.11,76.39 124.24,76.39 R10.2 v128,77.75
  Bottom 0.203: v128,77.75 128.5,77.25 128.5,33.5 131.5,30.5 134.05,30.5 U3.10
GND  (via drill 0.35, 0.39, 0.4, 0.4 pad 0.2, 0.5, 1)
  Top 0.152: U1.7 86.83,23.64 v87.5,24.3 | U1.3 85.88,25.64
  Top 0.203: U1.1 84.01,26.64 83.41,27.23 83.34,27.23 v83.12,27.45 | C13.2 90.21,14.24 90.74,14.24 91.25,14.75 91.25,18.31 90.48,19.07 89.42,19.07 88.72,19.77 U1.18 88.72,23.14 U1.TP 87.72,24.14 U1.16 | TP6.P$1 64.96,25.09 TP2.P$1 | U1.11 85.22,20.66 v84.64,20.09 | U1.7 81.86,23.64 81.85,23.64 81.34,23.13 81.34,22.62 80.83,22.12 79.88,22.12 C25.2 | v75.53,17.19 75.53,16.25 75.6,16.18 75.56,16.15 C14.2 | U1.3 84,25.64 83.12,26.51 v83.12,27.45 | C20.2 82.55,27.9 v83.12,27.45 | R13.1 84.05,75 v86,75
  Top 0.35: R6.1 56.95,22.32
  Top 0.356: R5.2 v56.96,23.77 R6.1
  Top 0.406: C8.1 64.96,25.09 C7.2 | C10.1 C9.2
  Bottom 0.152: 21.05,66.75 21.35,67.05 v21.35,68.05
  Bottom 0.203: 20.9,78 v21.35,77.55
  Bottom 0.406: v56.96,23.77 56.96,24.91 | X3.P$7 21.05,66.75 | LS1.N 20.9,78
  other vias: 62.3,38.6 62.2,8.58 68.88,17.27 64.96,32.28 66.61,32.02 63.18,32.4 62.32,13.99 62.43,17.16 70.03,16.17 66.74,17.67 60.92,25.11 63.18,25.04 64.96,25.04 66.74,24.91 68.39,24.91 68.64,32.53 62.68,33.93 62.45,35.95 64.96,17.93 94.8,18.82 92.26,21.1 93.25,13.99 82.1,23.13 80.07,27.7 71.94,33.55 74.23,38.4 76.68,40.2 78.36,40.29 79.09,41.69 86.09,40.23 89.34,35.71 89.35,32.82 89.22,38.37 94.8,15.01 77.53,32.9 76.78,35.57 73.47,34.05 62.04,41.67 62.04,47.26 62.29,10.94 62.29,5.62 80.85,41.64 90.56,30.58 97.1,28.05 97.1,30.05 97.1,32.05 97.1,34.05 97.1,40.05 97.1,38.05 97.1,44.05 97.1,46.05 97.1,21.8 97.1,19.8 97.1,17.8 97.1,15.8 97.1,13.8 97.1,11.8 97.1,9.8 97.1,7.8 97.1,5.8 97.1,3.8 90.56,19.8 97.1,36.05 75.03,40.2 83.73,41.8 62.05,44.64 70.3,33.1 73.73,36.4 97.1,23.8 62.29,3.12 99.85,28.05 99.85,30.05 99.85,32.05 99.85,34.05 99.85,38.05 99.85,45.05 99.85,47.05 99.85,21.8 99.85,19.8 99.85,17.8 99.85,15.8 99.85,13.8 99.85,11.8 99.85,3.8 99.85,36.05 99.85,23.8 99.85,1.8 99.85,49.05 99.95,51.55 99.95,53.55 62.04,49.26 60.04,49.26 58.04,49.26 56.04,49.26 54.04,49.26 52.04,49.26 50.04,49.26 48.04,49.26 46.04,49.26 44.04,49.26 42.04,49.26 40.04,49.26 38.04,49.26 36.04,49.26 34.04,49.26 32.04,49.26 30.04,49.26 28.04,49.26 26.04,49.26 24.04,49.26 22.04,49.26 20.04,49.26 18.04,49.26 16.04,49.26 14.04,49.26 12.04,49.26 10.04,49.26 8.04,49.26 6.04,49.26 4.04,49.26 2.04,49.26 121.92,76.37 99.85,61.05 101.85,61.05 103.85,61.05 105.85,61.05 107.85,61.05 109.85,61.05 111.85,61.05 113.85,61.05 115.85,61.05 117.85,61.05 119.85,61.05 121.85,61.05 123.85,61.05 125.85,61.05 127.85,61.05 129.85,61.05 131.85,61.05 137.85,61.05 21.35,83.55 21.35,81.55 21.35,79.55 21.35,75.55 21.35,73.55 21.35,71.55 21.35,66.05 22.85,64.55 24.85,64.55 26.85,64.55 28.85,64.55 30.85,64.55 32.85,64.55 34.85,64.55 36.85,64.55 38.85,64.55 40.85,64.55 42.85,64.55 44.85,64.55 46.85,64.55 48.85,64.55 50.85,64.55 52.85,64.55 54.85,64.55 56.85,64.55 58.85,64.55 60.85,64.55 62.85,64.55 64.85,64.55 66.85,64.55 68.85,64.55 70.85,64.55 72.85,64.55 74.85,64.55 76.85,64.55 78.85,64.55 80.85,64.55 82.85,64.55 84.85,64.55 86.85,64.55 88.85,64.55 90.85,64.55 92.85,64.55 94.85,64.55 96.85,64.55 98.85,64.55 100.85,64.55 102.85,64.55 104.85,64.55 106.85,64.55 108.85,64.55 110.85,64.55 112.85,64.55 114.85,64.55 116.85,64.55 118.85,64.55 120.85,64.55 122.85,64.55 124.85,64.55 126.85,64.55 129.35,64.55 131.35,64.55 133.35,64.55 135.35,64.55 137.35,64.55 97.1,48.05 64.04,49.26 66.04,49.26 68.04,49.26 70.04,49.26 72.04,49.26 74.04,49.26 76.04,49.26 79.54,49.26 81.54,49.26 83.54,49.26 85.54,49.26 87.54,49.26 89.54,49.26 91.54,49.26 93.54,49.26 95.54,49.26 135.85,61.05 70.53,14.67 70.53,12.67 70.53,10.67 71.03,8.67 73.03,8.17 75.03,8.17 77.03,8.17 78.03,9.17 79.03,10.17 80.03,11.17 82.03,11.17 84.03,11.17 86.03,11.17 88.03,11.17 90.03,11.17 91.53,11.67 92.25,12.99 66,74.3
  pour Top (isolate 0.305): 71.69,50.33 97.79,50.33 97.79,1 70.69,1 70.69,13.48 78.04,13.48 78.04,28.98 71.69,28.98
  pour Top (isolate 0.406): 61.5,50.33 71.44,50.33 71.44,1 61.5,1
  pour Top (isolate 0.406): 71.69,26.43 74.99,26.43 74.99,23.39 71.69,23.39
  pour Bottom (isolate 0.406): 1.58,1.04 97.75,1.04 97.75,50.29 1.58,50.29
  pour Bottom: 99,1 139,1 139,61.5 99,61.5
  pour Top: 99,1 139,1 139,61.5 99,61.5
  pour Top: 139,64 139,84.5 20.5,84.5 20.5,66 22.5,64
  pour Bottom: 139,64 139,84.5 20.5,84.5 20.5,66 22.5,64
  pour Top: 75,64 75,47.5 81.5,47.5 81.5,64.5 75,64.5
  pour Top: 133,65 133,60 133.5,59.5 137,59.5 137,65
MISO
  Top 0.203: U1.29 103.61,26.14 105.85,23.9 105.85,6.05 107.1,4.8 117.95,4.8 119.9,6.75 119.9,12.47 130.41,22.98 U3.13
MOSI
  Top 0.203: U1.28 102.89,25.64 105.15,23.38 105.15,5.9 107.05,4 118.05,4 120.5,6.45 120.5,12 126.4,17.9 U3.15
N$1
  Top 0.203: U1.4 83.66,25.14 82.74,26.05 L3.2
N$2
  Top 0.203: U1.6 81.33,24.14 80.58,23.39 L4.2
N$3
  Top 0.203: C1.2 C5.2 | 78.04,25.99 L3.1 | 72.66,27.66 73.21,27.66 73.21,27.58
  Top 0.406: TP1.P$1 72.66,28.15 72.66,27.66 71.56,26.56 70.51,26.56 C3.1 C1.2 | 78.04,25.99 75.81,25.99 74.36,27.45 73.34,27.45 73.21,27.58
N$4
  Top 0.356: TP5.P$1 60.01,32.77 60.01,46.24 58.23,48.02 4.12,48.02 2.09,45.99 2.09,25.42 3.11,24.4 3.11,4.08 4.12,3.07 58.23,3.07 58.99,3.83 58.99,24.91 57.97,25.93 57.97,44.72 56.7,45.99 5.14,45.99 4.12,44.98 4.12,25.42 5.14,24.4 5.14,5.86 5.9,5.1 56.45,5.1 56.96,5.61 R6.2
  Top 0.406: TP5.P$1 R3.1
N$5  (via drill 0.5)
  Top 0.356: v2.09,23.89 2.09,3.58 3.62,2.05 58.73,2.05 60.01,3.33 60.01,17.42 TP4.P$1 | v3.11,25.93 3.11,45.48 4.63,47.01 57.47,47.01 58.99,45.48 v58.99,26.31 | v57.97,24.53 57.97,4.59 57.47,4.08 4.89,4.08 4.12,4.84 v4.12,23.89 | v5.14,25.93 5.14,44.22 5.9,44.98 56.2,44.98 56.96,44.22 R5.1 56.96,28.98
  Top 0.406: R4.2 60.77,18.43 TP4.P$1
  Bottom 0.406: v3.11,25.93 v2.09,23.89 | v58.99,26.31 v57.97,24.53 | v4.12,23.89 v5.14,25.93
N$6
  Bottom 0.406: R8.1 110.78,81.8 LED1.C
N$7
  Top 0.203: C12.1 83.31,14.21 Y1.1 85.63,14.24 86.31,14.24 86.72,14.65 U1.14
N$8
  Top 0.203: C13.1 90.07,15.8 Y1.2 87.22,16.38 U1.15
N$9
  Top 0.254: R2.1 73.21,12.02 C15.1
N$10  (via drill 0.5)
  Top 0.203: U1.9 83.64,22.64 83.12,22.12 83.12,19.07 79.82,15.77 C14.1 78.03,16.59 v79.1,16.59 | R1.2 v79.07,13.24
  Bottom 0.203: v79.1,16.59 79.1,14.01 v79.07,13.24
N$11
  Top 0.203: U1.10 83.9,22.14 83.63,21.86 83.63,18.82 79.32,14.51 76.02,14.51 75.5,13.99 R1.1 75.56,11.34 C15.2
N$12
  Top 0.203: TP7.P$1 TP3.P$1
  Top 0.254: R2.2 TP7.P$1
  Top 0.406: C2.1 C6.1 C4.2 70.25,23.14 71.69,23.39 73.21,22.37 TP3.P$1 73.72,22.5 73.97,22.5 74.74,23.26 L4.1
N$13
  Top 0.203: L2.1 76.64,18.31
  Top 0.254: U1.8 83.38,23.14 82.36,22.12 82.36,21.36 81.85,20.85 C25.1 C11.1 80.41,18.14 79.95,17.68 77.27,17.68 76.64,18.31
N$14  (via drill 0.41, 0.5)
  Top 0.203: U1.5 83.39,24.64 82.99,25.04 v81.85,25.04
  Top 0.305: C23.1 80.42,31.45 C19.1 | v81.34,32.65 80.79,32.53
  Top 0.406: 80.42,31.45 80.79,31.84 80.79,32.53 L1.1
  Bottom 0.305: v81.85,25.04 81.85,31.77 81.34,32.28 v81.34,32.65
N$15
  Top 0.254: U1.37 86.72,35.32 86.81,35.42 C22.2
N$16
  Bottom 0.203: 103,15.7 102.95,15.65
  Bottom 0.406: LS1.P 3.2,55.8 8,51 98.9,51 103,46.9 103,15.7 | 102.95,15.65 102.95,8.05 106,5 126,5 128.5,7.5 128.5,25 131.56,28.06 U3.11
N$17
  Top 0.203: R11.1 84,69 | 84,69 R12.2 | IC3.3 81,71.69 81,70 82,69 84,69
N$18
  Top 0.152: R12.1 84,73 R13.2
  Top 0.203: IC3.4 80.95,74.95 81.5,75.5 82,75.5 82.5,75 82.5,73.5 83,73 84,73
N$19
  Top 0.203: R14.1 76.53,72.03 | 76.53,72.03 77.55,71 78.5,71 79.05,71.55 IC3.1 IC3.6 | IC1.2 61.94,74.94 61.5,74.5 61.5,72 62.5,71 75.5,71 76.53,72.03
N$20
  Top 0.406: 63.15,76.41 IC1.1 62.8,76.2 61.5,77.5 61.5,81.05 62.95,82.5 71,82.5 75,78.5 U$46.P$1
  Top 0.61: C27.1 63.15,76.41
N$21  (via drill 0.35)
  Top 0.152: R15.1 130.55,78.05 v130.5,78
  Bottom 0.152: v130.5,78 130.5,72.6 131.8,71.3 135.3,71.3 136.5,72.5 136.5,76.2 135.97,76.72 X1.B5
N$22
  Top 0.152: R16.1 131.35,82.2 132.2,81.35 132.2,79.7 132.62,79.28 X1.A5
N$23
  Bottom 0.203: U3.32 106.02,22.98 103.75,25.25 103.75,52.25 101.25,54.75 X3.P$1
N$25
  Bottom 0.203: U3.31 105.98,25.52 104.5,27 104.5,52.5 101.5,55.5 20.75,55.5 19.5,56.75 X3.P$2
N$26
  Bottom 0.203: U3.30 106.5,28.06 105.25,29.31 105.25,52.75 101.75,56.25 22,56.25 19.5,58.75 X3.P$3
N$27
  Bottom 0.203: U3.29 107.4,30.6 105.86,32.14 105.86,53.14 102,57 23.25,57 19.5,60.75 X3.P$4
N$28
  Bottom 0.203: U3.28 107.61,33.14 106.5,34.25 106.5,53.5 102.25,57.75 24.5,57.75 19.5,62.75 X3.P$5
N$29
  Bottom 0.203: X3.P$6 19.5,64.75 25.75,58.5 102.5,58.5 107.25,53.75 107.25,52 108.33,50.92 U3.21
N$30
  Top 0.203: IC2.4 119.83,75.88 R9.2
N$32  (via drill 0.35)
  Top 0.203: R10.1 125.6,81.15 v125.55,81.2
  Bottom 0.203: v125.55,81.2 124.95,81.8 LED2.C
N$34
  Top 0.152: X1.B9 135.88,80.12 136.4,79.6 136.4,76.5 135.78,75.88 X1.B4
  Top 0.203: X1.A4 X1.B9
  Top 0.3: 124.32,75.88 IC2.1
  Top 0.406: X1.B4 X1.A9 125.5,75.88 | 125.5,75.88 124.33,75.88 124.32,75.88 | C18.1 125.5,75.88
RSTPD_N
  Top 0.203: U1.38 86.22,32.86 81.53,37.55 79.22,37.55 79.22,37.59 R7.2
SCK
  Top 0.203: U1.30 103.92,26.64 106.45,24.1 106.45,6.4 107.35,5.5 117.75,5.5 119.19,6.94 119.19,12.84 131.87,25.52 U3.12
SS  (via drill 0.5)
  Top 0.203: U1.27 102.52,25.14 104.55,23.1 104.55,15.9 v104.05,15.4
  Bottom 0.203: U3.35 104.09,15.36 v104.05,15.4
TX1_ANTENNA
  Top 0.203: C9.1 C7.1 C1.1 C5.1
  Top 0.406: C9.1 62.88,28.12 62.28,28.12 61.68,27.52 R3.2
TX2_ANTENNA
  Top 0.203: C10.2 C8.2 C2.2 C6.2
  Top 0.406: C10.2 62.52,21.43 61.43,22.52 60.94,22.52 R4.1
V_BAT  (via drill 0.35, 1)
  Top 0.203: v119.65,80.5 119.65,77.27 120.53,76.38 IC2.5 | R14.2 76.5,75 77,75.5 79.5,75.5 80,75 | 88.3,76.3 87,75 R11.2
  Top 0.3: IC2.5 119.38,76.38
  Top 0.406: 69.05,76.51 68.75,76.2 IC1.8 68.74,76.3 80,76.3 | IC3.5 80,75 80,76.3 | 80,76.3 88.3,76.3 v95.7,76.3 95.75,76.25 95.8,76.3 115.2,76.3 115.55,75.95 C28.1 116.03,76.38 119.38,76.38
  Top 0.61: 69.05,76.51 C26.1
  Bottom 0.152: U$24.+ 93,73.6 v95.7,76.3
  Bottom 0.203: LED2.A 120.95,81.8 v119.65,80.5
VCC  (via drill 0.5)
  Top 0.203: C24.1 76.01,37.04 R7.1
  Top 0.254: U1.39 85.72,32.53 84.7,33.55 83.43,33.55 C17.1
  Top 0.305: L2.2 76.64,21.79 v76.57,21.86 | v74.03,32.53 75.23,33.73 C24.1 76.33,34.05 L1.2 79.09,35.05 79.36,35.33 82.41,35.33 82.92,34.82 C17.1
  Bottom 0.305: v76.57,21.86 76.57,32.28 76.32,32.53 v74.03,32.53
VDD  (via drill 0.35, 0.5)
  Top 0.203: C16.1 94.63,23.14 v93.28,23.14 v93.28,23.13 v93.28,23.14 U1.23 | U1.40 84.78,27.38 84.7,27.45 84.7,28.97 C20.1 | U1.17 88.22,18.58 v88.3,18.5
  Top 0.254: C20.1 84.45,32.08 v84.64,32.28
  Top 0.406: 59.5,70.5 63,67 78,67 | 78,67 78,46.14 82.5,41.64 C21.1 84.63,39.64 v84.69,39.58 | C29.1 131.89,53.46 U3.1 134.15,64.96 132.11,67 78,67 | v19.5,69.5 58.5,69.5 59.5,70.5 | 59.5,70.5 59.5,81 62,83.5 72,83.5 75.5,80 v106,80 108.15,80 U$46.P$2
  Bottom 0.35: v84.69,39.58 84.74,39.53 90.17,39.53 93.29,36.41 93.29,23.14 v93.28,23.13
  Bottom 0.406: v84.69,39.58 84.69,32.33 v84.64,32.28 | v88.3,18.5 92.3,18.5 93.29,19.49 93.29,23.14 | v19.5,69.5 18.75,68.75 X3.P$8 | v106,80 106,81.66 LED1.A

### Text on the board
bPlace: POWER | CHARGE
tNames: RallyESPShield / 02/2021 V1 / Max Holzmann | R2